# EAGLE design 0128_LED2 (EAGLE 9.6.0)
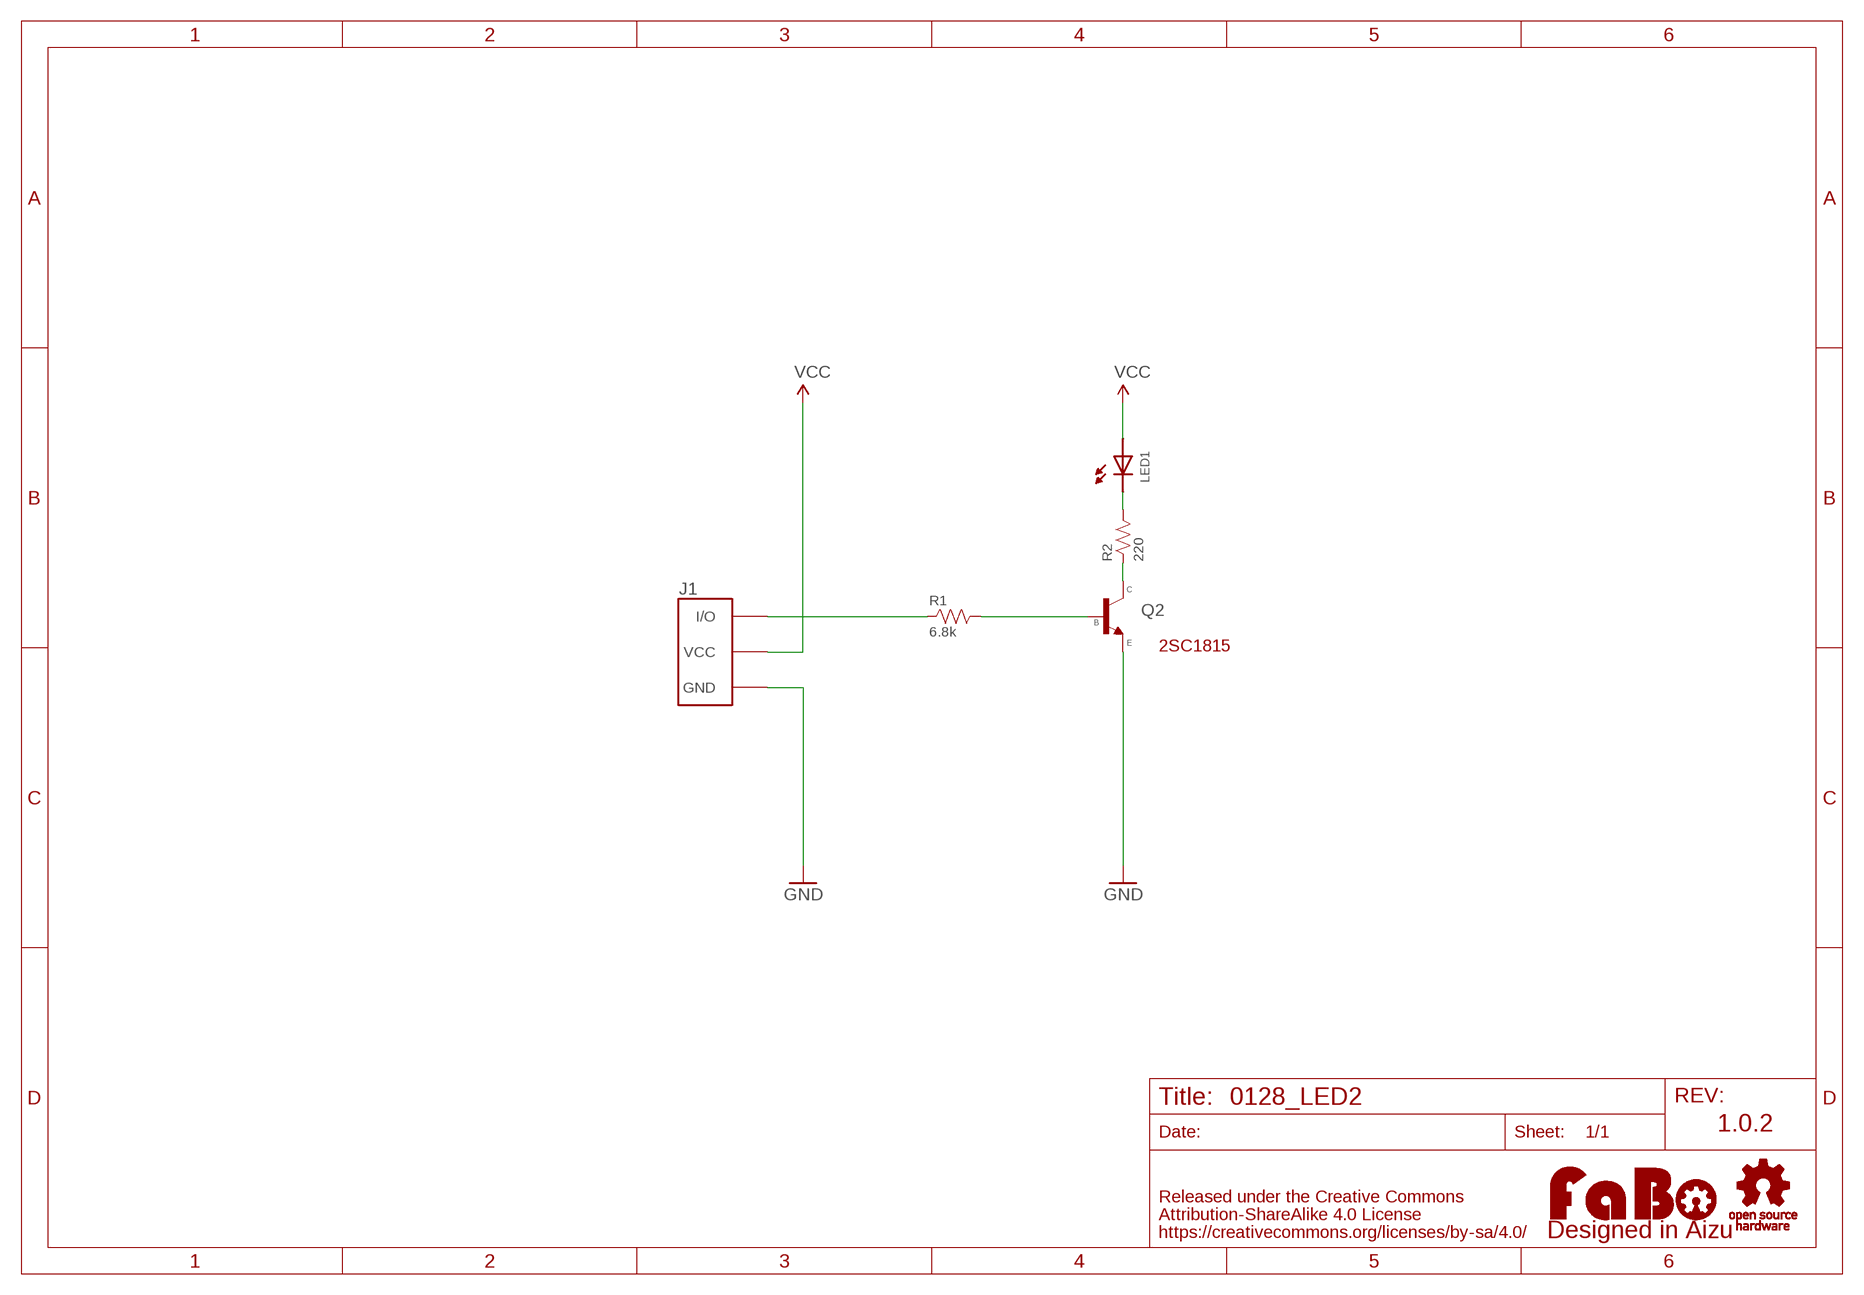
[diagram p0: schematic, sheet 1]

## Parts
J1  FABO_BRICK_3PIN  [FABO_BRICK_3PIN]
LED1  LED-5MM  [LED_5MM]
LOGO1  LOGO_FABO-M  [LOGO_FABO_M]
Q2  NPN-2SC1815  [TO-92]
R1  6.8k  RESISTOR-AXL-REGULAR  [AXL-REGULAR]
R2  220  RESISTOR-AXL-REGULAR  [AXL-REGULAR]
U$6  LOGO_OSHW-M_BOTTOM  [LOGO_OSHW_M_BOTTOM]

## Nets
GND: J1.GND Q2.1(E)
N$1: J1.I/O R1.1
N$2: Q2.2(C) R2.1
N$3: LED1.K(CATHODE) R2.2
N$6: Q2.3(B) R1.2
VCC: J1.VCC LED1.A(ANODE)

## Notes on the sheet
- 2SC1815
- 1.0.2

## Library data of the parts
J1 = FaBo-Template:FABO_BRICK_3PIN: FaBo Brick 3pin
LED1 = FaBo-LED:LED
LOGO1 = component:LOGO_FABO
Q2 = FaBo-Parts:NPN
R1 R2 = FaBo-Resistors:RESISTOR: RESISTOR
U$6 = FaBo-etc:LOGO_OSHW

## Board
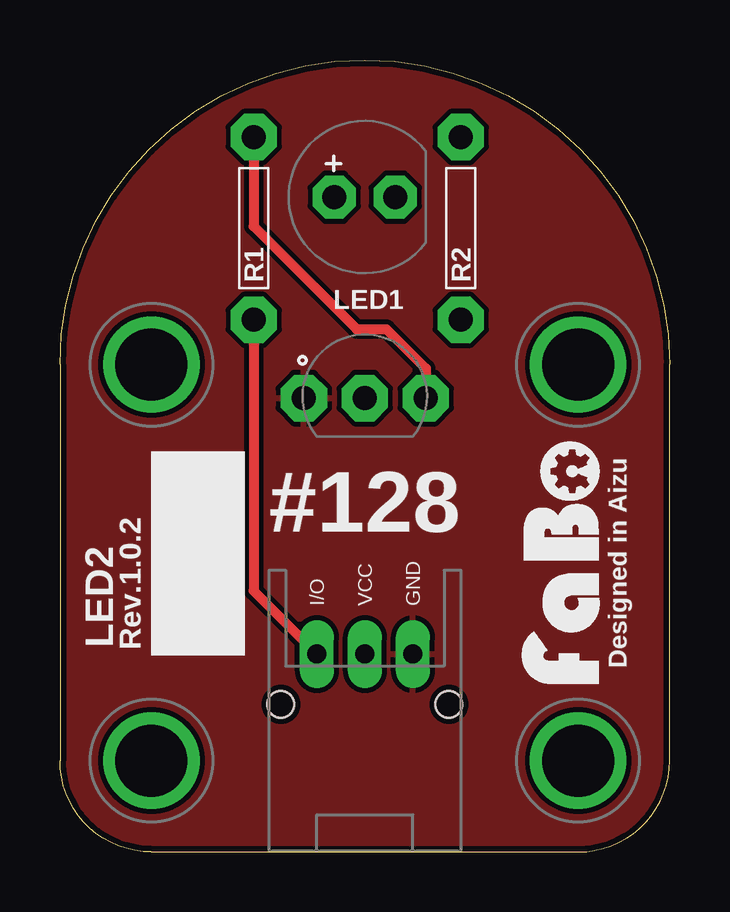
[diagram p1: board, top side]
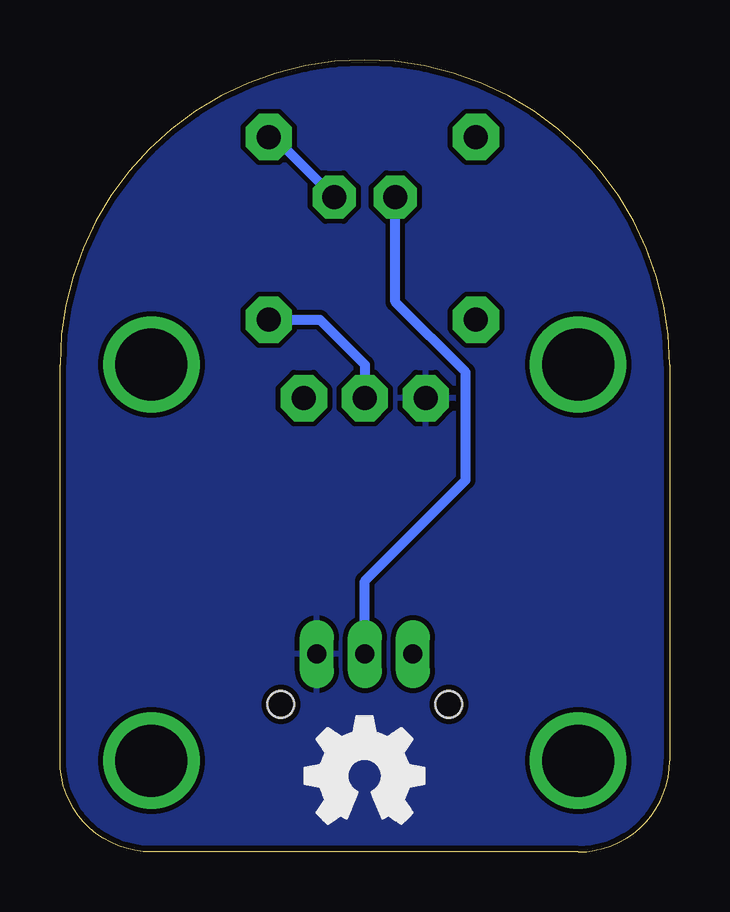
[diagram p2: board, bottom side, seen from below]

Size 25.4 x 33.02 mm. Coordinates in mm from the lower left corner, seen from the top.
Copper layers (1*16): Top 0.035mm / dielectric 1.6mm / Bottom 0.035mm
Design rules "PCBway": minimum track width 6mil, minimum drill 12mil, track to track 6mil, track to pad 6mil, pad to pad 6mil, via to via 6mil, smd to smd 6mil, copper to edge 10mil, drill to drill 10mil, minimum pad ring 10mil, minimum via ring 6mil, stop-mask expansion 2mil, vias tented up to drill 100mil, thermal gap 8mil

### Footprints (pad centres in the part's own frame; a part is rotated, then mirrored left to right if it is on the bottom)
FABO_BRICK_3PIN = drill 0.8 pad 1.422 long: GND 2,-8.255; I/O -2,-8.255; VCC 0,-8.255 | drill 3 pad 3.81: P$1 -8.89,3.81; P$2 8.89,3.81; P$3 -8.89,-12.7; P$4 8.89,-12.7 | hole 1.1: -3.5,-10.355; 3.5,-10.355
LED_5MM = drill 1 pad 1.8 octagon: A -1.27,0; K 1.27,0
TO-92 = drill 1 pad 1.93 octagon: 1 -2.54,0; 2 0,0; 3 2.54,0
AXL-REGULAR = drill 1 pad 1.93 octagon: 1 -3.81,0; 2 3.81,0

### Placement (x,y rotation side)
J1  12.7,16.51 0 top
LED1  12.7,27.3 0 top
LOGO1  22.86,12.06 90 top
Q2  12.7,18.92 0 top
R1  8.07,26 90 top
R2  16.7,26 90 top
U$6  12.7,3.17 0 top

### Tracks (layer width: path | path; a pad name or v marks a point on that pad's centre or on a via)
GND
  pour Bottom (isolate 0.203): 0,0 25.4,0 25.4,33.02 0,33.02
  pour Top (isolate 0.203): 0,0 25.4,0 25.4,33.02 0,33.02
N$1
  Top 0.406: R1.1 8.07,10.88 J1.I/O
N$2
  Bottom 0.406: Q2.2 12.7,20.32 14.57,22.19 R2.1
N$3
  Bottom 0.406: R2.2 16.48,29.81 LED1.K
N$6
  Top 0.406: R1.2 8.07,26.09 12.36,21.8 13.6,21.8 15.24,20.16 Q2.3
VCC
  Bottom 0.406: J1.VCC 12.7,11.3 8.5,15.5 8.5,20 11.43,22.93 LED1.A

### Text on the board
tPlace: #128 | Designed in Aizu | LED2 | Rev.1.0.2